# Altium project VincereVentusV3.PrjPcb
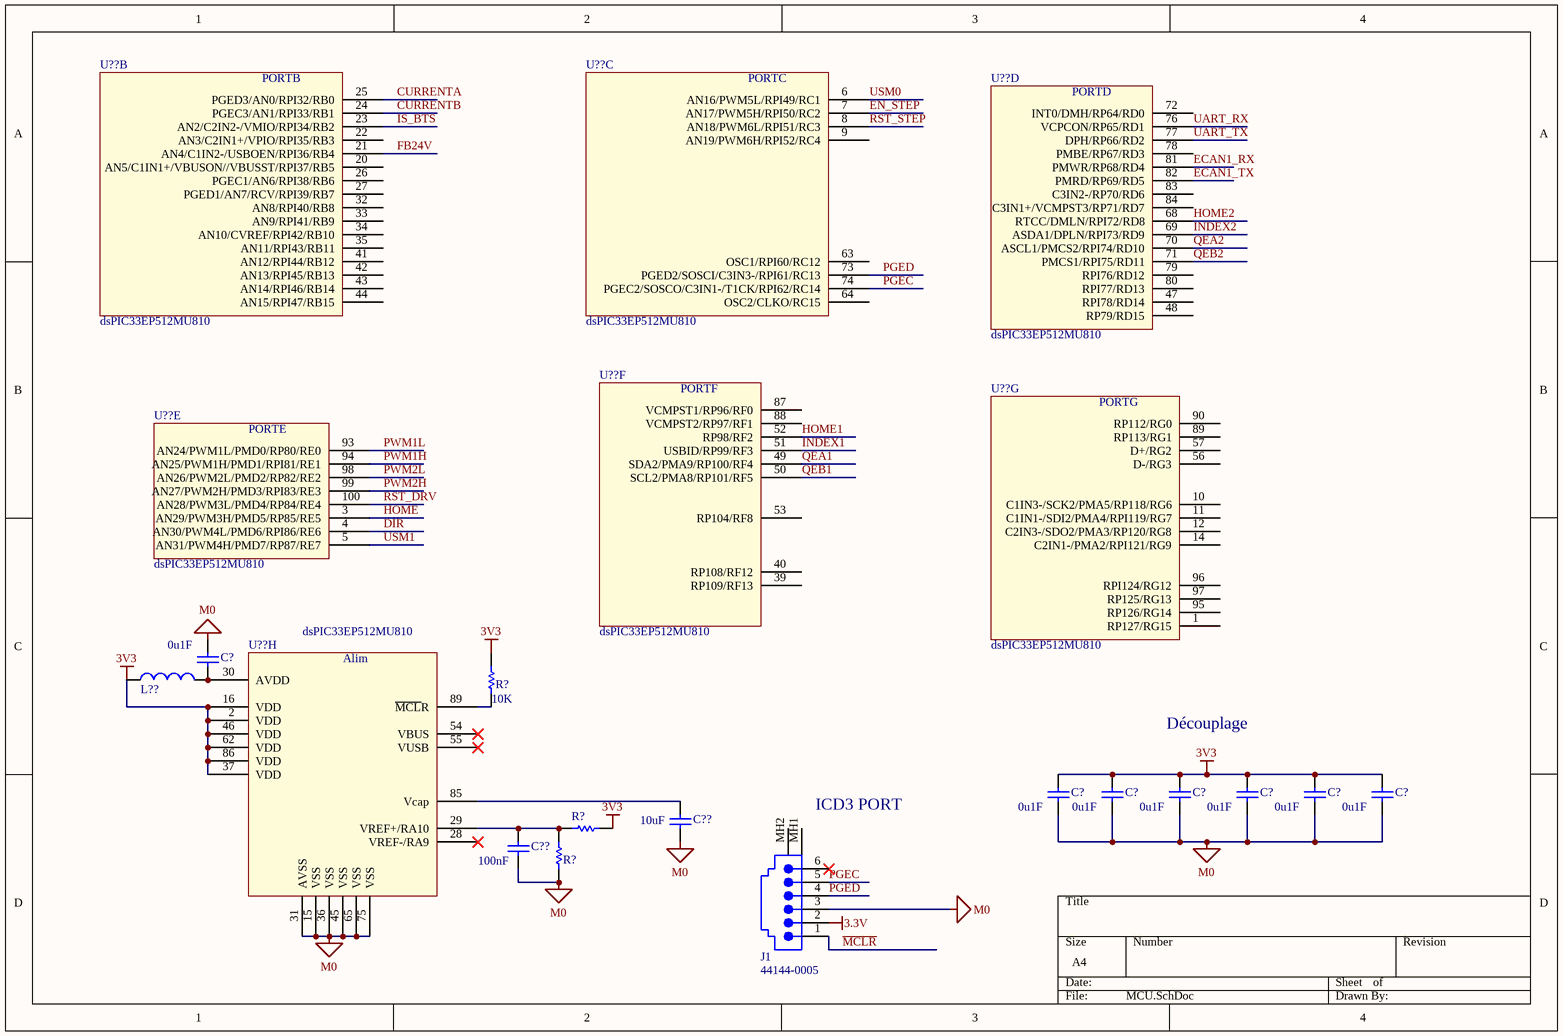
[diagram p0: MCU.SchDoc]
5 sheets, 161 parts. Net scope: global (net labels, ports and power ports of the same name join across sheets).
Board file: HARDWARE_DRIVE_V3.PcbDoc
Sheets:
  MCU.SchDoc
  MOTOR_DRIVER1.SchDoc
  ALIM.SchDoc
  MOTOR_DRIVERS2.SchDoc
  Connectors.SchDoc

## Sheet MCU.SchDoc
size A4

### Parts
(Parts that share a designator on the sheet are numbered #1, #2 ... from top to bottom, then left to right.)
C?#1  value 0u1F  [0603]  (hidden comment: C0603)
C?#2  value 0u1F  [0603]  (hidden comment: C0603)
C?#3  value 0u1F  [0603]  (hidden comment: C0603)
C?#4  value 0u1F  [0603]  (hidden comment: C0603)
C?#5  value 0u1F  [0603]  (hidden comment: C0603)
C?#6  value 0u1F  [0603]  (hidden comment: C0603)
C?#7  value 0u1F  [0603]  (hidden comment: C0603)
C??#1  10uF  [C0805]
C??#2  100nF  [C0805]
J1  44144-0005  [44144-0005]
L??  Ferrite_0805  [R0805]  (value not drawn)
R?#1  10K  [R0805]
R?#2  (no value)  [R0805]
R?#3  (no value)  [R0805]
U??#1  dsPIC33EP512MU810  (part C of 8)
U??#2  dsPIC33EP512MU810  (part B of 8)
U??#3  dsPIC33EP512MU810  (part D of 8)
U??#4  dsPIC33EP512MU810  (part E of 8)
U??#5  dsPIC33EP512MU810  (part G of 8)
U??#6  dsPIC33EP512MU810  (part F of 8)
U??#7  dsPIC33EP512MU810  (part H of 8)

### Nets
3.3V: J1.2
3V3: C?#2.2 C?#3.2 C?#4.2 C?#5.2 C?#6.2 C?#7.2 R?#1.2 R?#2.1 U??#7.2(VDD) U??#7.16(VDD) U??#7.37(VDD) U??#7.46(VDD) U??#7.62(VDD) U??#7.86(VDD)
M0: C?#1.2 C?#2.1 C?#3.1 C?#4.1 C?#5.1 C?#6.1 C?#7.1 C??#1.2 C??#2.2 J1.3 R?#3.1 U??#7.15(VSS) U??#7.31(AVSS) U??#7.36(VSS) U??#7.45(VSS) U??#7.65(VSS) U??#7.75(VSS)
CURRENTA: U??#2.25(PGED3/AN0/RPI32/RB0)
CURRENTB: U??#2.24(PGEC3/AN1/RPI33/RB1)
DIR: U??#4.4(AN30/PWM4L/PMD6/RPI86/RE6)
ECAN1_RX: U??#3.81(PMWR/RP68/RD4)
ECAN1_TX: U??#3.82(PMRD/RP69/RD5)
EN_STEP: U??#1.7(AN17/PWM5H/RPI50/RC2)
FB24V: U??#2.21(AN4/C1IN2-/USBOEN/RPI36/RB4)
HOME: U??#4.3(AN29/PWM3H/PMD5/RP85/RE5)
HOME1: U??#6.52(RP98/RF2)
HOME2: U??#3.68(RTCC/DMLN/RPI72/RD8)
INDEX1: U??#6.51(USBID/RP99/RF3)
INDEX2: U??#3.69(ASDA1/DPLN/RPI73/RD9)
IS_BTS: U??#2.23(AN2/C2IN2-/VMIO/RPI34/RB2)
~{MCLR}: J1.1
PGEC: J1.5 U??#1.74(PGEC2/SOSCO/C3IN1-/T1CK/RPI62/RC14)
PGED: J1.4 U??#1.73(PGED2/SOSCI/C3IN3-/RPI61/RC13)
PWM1H: U??#4.94(AN25/PWM1H/PMD1/RPI81/RE1)
PWM1L: U??#4.93(AN24/PWM1L/PMD0/RP80/RE0)
PWM2H: U??#4.99(AN27/PWM2H/PMD3/RPI83/RE3)
PWM2L: U??#4.98(AN26/PWM2L/PMD2/RP82/RE2)
QEA1: U??#6.49(SDA2/PMA9/RP100/RF4)
QEA2: U??#3.70(ASCL1/PMCS2/RPI74/RD10)
QEB1: U??#6.50(SCL2/PMA8/RP101/RF5)
QEB2: U??#3.71(PMCS1/RPI75/RD11)
RST_DRV: U??#4.100(AN28/PWM3L/PMD4/RP84/RE4)
RST_STEP: U??#1.8(AN18/PWM6L/RPI51/RC3)
UART_RX: U??#3.76(VCPCON/RP65/RD1)
UART_TX: U??#3.77(DPH/RP66/RD2)
USM0: U??#1.6(AN16/PWM5L/RPI49/RC1)
USM1: U??#4.5(AN31/PWM4H/PMD7/RP87/RE7)
NetC?#1_1: C?#1.1 L??.2 U??#7.30(AVDD)
NetC??#1_1: C??#1.1 U??#7.85(Vcap)
NetC??#2_1: C??#2.1 R?#2.2 R?#3.2 U??#7.29(VREF+/RA10)
NetR?#1_1: R?#1.1 U??#7.89(~{MCL}R)

Not connected (* = marked no-connect by the designer): J1 6* MH1(Shield) MH2(Shield); L?? 1; U??#1 9(AN19/PWM6H/RPI52/RC4) 63(OSC1/RPI60/RC12) 64(OSC2/CLKO/RC15); U??#2 20(AN5/C1IN1+/VBUSON//VBUSST/RPI37/RB5) 22(AN3/C2IN1+/VPIO/RPI35/RB3) 26(PGEC1/AN6/RPI38/RB6) 27(PGED1/AN7/RCV/RPI39/RB7) 32(AN8/RPI40/RB8) 33(AN9/RPI41/RB9) 34(AN10/CVREF/RPI42/RB10) 35(AN11/RPI43/RB11) 41(AN12/RPI44/RB12) 42(AN13/RPI45/RB13) 43(AN14/RPI46/RB14) 44(AN15/RPI47/RB15); U??#3 47(RPI78/RD14) 48(RP79/RD15) 72(INT0/DMH/RP64/RD0) 78(PMBE/RP67/RD3) 79(RPI76/RD12) 80(RPI77/RD13) 83(C3IN2-/RP70/RD6) 84(C3IN1+/VCMPST3/RP71/RD7); U??#5 1(RP127/RG15) 10(C1IN3-/SCK2/PMA5/RP118/RG6) 11(C1IN1-/SDI2/PMA4/RPI119/RG7) 12(C2IN3-/SDO2/PMA3/RP120/RG8) 14(C2IN1-/PMA2/RPI121/RG9) 56(D-/RG3) 57(D+/RG2) 89(RP113/RG1) 90(RP112/RG0) 95(RP126/RG14) 96(RPI124/RG12) 97(RP125/RG13); U??#6 39(RP109/RF13) 40(RP108/RF12) 53(RP104/RF8) 87(VCMPST1/RP96/RF0) 88(VCMPST2/RP97/RF1); U??#7 28(VREF-/RA9)* 54(VBUS)* 55(VUSB)*

### Notes on the sheet
- Découplage
- (near J1) ICD3 PORT
- (in symbol dsPIC33EP512MU810-I/PF, part B) PORTB
- (in symbol dsPIC33EP512MU810-I/PF, part C) PORTC
- (in symbol dsPIC33EP512MU810-I/PF, part D) PORTD
- (in symbol dsPIC33EP512MU810-I/PF, part E) PORTE
- (in symbol dsPIC33EP512MU810-I/PF, part F) PORTF
- (in symbol dsPIC33EP512MU810-I/PF, part G) PORTG
- (in symbol dsPIC33EP512MU810-I/PF, part H) Alim

### Library data of the parts
C?#1-C?#7 = C0603: Ceramic Chip Capacitor - Standard; Note: Footprint corresponds to dimensions for bulk cassette packaging. This case size has tightened tolerances.; Published: 17-Jul-2002; LatestRevisionDate: 19-Mar-2004; LatestRevisionNote: Silkscreen size reduced.; DatasheetDocument: Mar-2001; PackageDocument: Mar-2001; PackageReference: 0603; Publisher: Altium Limited; Code_JEITA: 0603; Code_IPC: 1608 [0603]; ComponentLink1Description: Manufacturer Link; ComponentLink1URL: http://www.kemet.com/; ComponentLink2Description: Datasheet; ComponentLink2URL: http://www.kemet.com/kemet/web/homepage/kechome.nsf/vapubfilesname/F3102TA.pdf/$file/F3102TA.pdf
C??#1 C??#2 = C0805: Ceramic Chip Capacitor - Standard; Note: Footprint corresponds to dimensions for bulk cassette packaging. This case size has tightened tolerances.; Value: 100pF; Published: 17-Jul-2002; LatestRevisionDate: 19-Mar-2004; LatestRevisionNote: Silkscreen size reduced.; DatasheetDocument: Mar-2001; PackageDocument: Mar-2001; PackageReference: 0805; Publisher: Altium Limited; Code_JEITA: 0805; Code_IPC: 2012[0805]; ComponentLink1Description: Manufacturer Link; ComponentLink1URL: http://www.kemet.com/; ComponentLink2Description: Datasheet; ComponentLink2URL: http://www.kemet.com/kemet/web/homepage/kechome.nsf/vapubfilesname/F3102TA.pdf/$file/F3102TA.pdf
J1 = 44144-0005: SMT, Right Angle, Low Profile, with Flush Fitting Nails PCB Jack; Ports: 1; Positions/Loaded: Port1 - 6/6; PerformanceCategory: 3; DrillSize: Nominal, Rounded to nearest 0.05mm; PCB_Layout: Complies with Manufacturer's Recommendation.; Published: 25-Jun-2002; DatasheetDocument: 19-Dec-2001; PackageDocument: 19-Dec-2001; PackageReference: 44144-0005; Publisher: Altium Limited; PCB_Mounting: SMT; ComponentLink1Description: Manufacturer Link; ComponentLink1URL: http://www.molex.com/; ComponentLink2Description: Datasheet; ComponentLink2URL: http://www.molex.com/cmc_upload/common_files/1222003_mx44144.pdf
L?? = Ferrite_0805: Ferrite
R?#1-R?#3 = R0805: Resistor 0805
U??#1-U??#7 = dsPIC33EP512MU810-I/PF: High-Performance, 16-bit  Digital Signal Controllers  and Microcontrollers; Supplier 1: Digi-Key; Supplier Part Number 1: DSPIC33EP512MU810-I/PF-ND

## Sheet MOTOR_DRIVER1.SchDoc
size A4
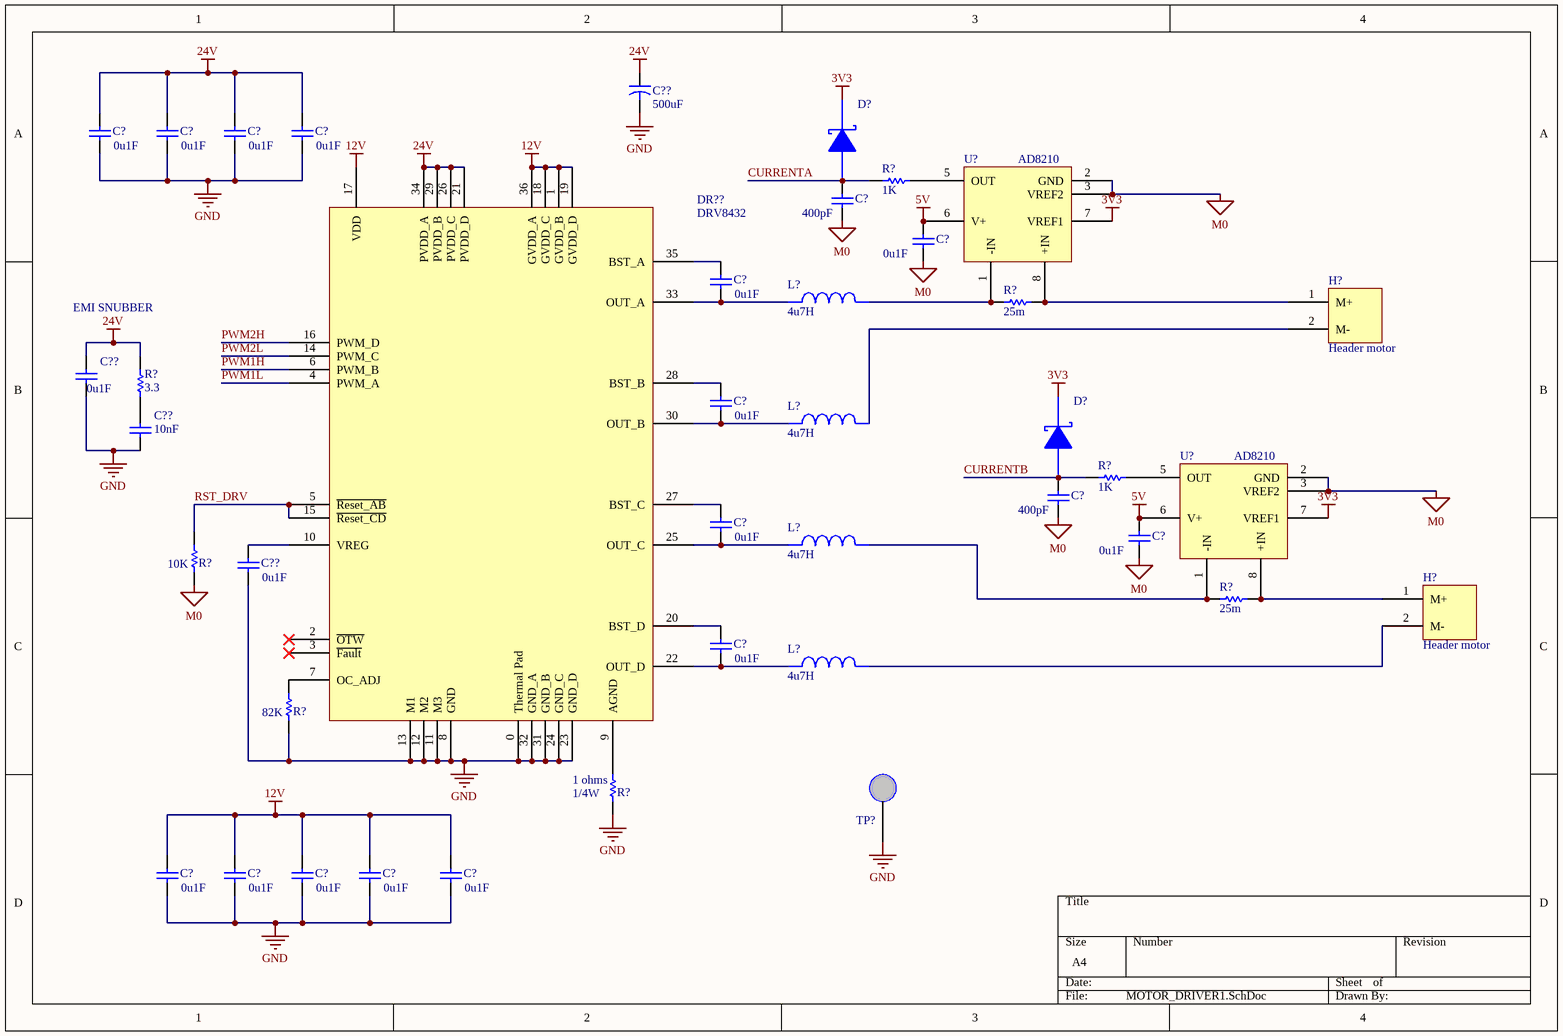
[diagram p1: MOTOR_DRIVER1.SchDoc]

### Parts
(Parts that share a designator on the sheet are numbered #1, #2 ... from top to bottom, then left to right.)
C?#8  value 0u1F  [0603]  (hidden comment: C0603)
C?#9  value 0u1F  [0603]  (hidden comment: C0603)
C?#10  value 0u1F  [0603]  (hidden comment: C0603)
C?#11  value 0u1F  [0603]  (hidden comment: C0603)
C?#12  value 400pF  [0603]  (hidden comment: C0603)
C?#13  value 0u1F  [0603]  (hidden comment: C0603)
C?#14  value 0u1F  [0603]  (hidden comment: C0603)
C?#15  value 0u1F  [0603]  (hidden comment: C0603)
C?#16  value 400pF  [0603]  (hidden comment: C0603)
C?#17  value 0u1F  [0603]  (hidden comment: C0603)
C?#18  value 0u1F  [0603]  (hidden comment: C0603)
C?#19  value 0u1F  [0603]  (hidden comment: C0603)
C?#20  value 0u1F  [0603]  (hidden comment: C0603)
C?#21  value 0u1F  [0603]  (hidden comment: C0603)
C?#22  value 0u1F  [0603]  (hidden comment: C0603)
C?#23  value 0u1F  [0603]  (hidden comment: C0603)
C?#24  value 0u1F  [0603]  (hidden comment: C0603)
C??#3  500uF
C??#4  value 0u1F  [C0805]  (hidden comment: C0805)
C??#5  value 10nF  [C0805]  (hidden comment: C0805)
C??#6  0u1F  [C0805]
D?#1  CRS08  (value not drawn)
D?#2  CRS08  (value not drawn)
DR??  DRV8432  [DRV8432]
H?#1  Header motor  [Header_motor_WEID]
H?#2  Header motor  [Header_motor_WEID]
L?#1  value 4u7H  (hidden comment: ChokeMotor)
L?#2  value 4u7H  (hidden comment: ChokeMotor)
L?#3  value 4u7H  (hidden comment: ChokeMotor)
L?#4  value 4u7H  (hidden comment: ChokeMotor)
R?#4  1K  [R0805]
R?#5  value 25m  [8RB-1206]  (hidden comment: 1206)
R?#6  value 3.3  [8RB-1206]  (hidden comment: 1206)
R?#7  1K  [R0805]
R?#8  10K  [R0805]
R?#9  value 25m  [8RB-1206]  (hidden comment: 1206)
R?#10  82K  [R0805]
R?#11  1 ohms  Power: 1/4W  [R0805]
TP?#1  5003K  [5003K]  (value not drawn)
U?#1  AD8210
U?#2  AD8210

### Nets
3V3: D?#1.2(A) D?#2.2(A) U?#1.7(VREF1) U?#2.7(VREF1)
5V: C?#13.2 C?#18.2 U?#1.6(V+) U?#2.6(V+)
12V: C?#20.2 C?#21.2 C?#22.2 C?#23.2 C?#24.2 DR??.1(GVDD_B) DR??.17(VDD) DR??.18(GVDD_C) DR??.19(GVDD_D) DR??.36(GVDD_A)
24V: C?#8.2 C?#9.2 C?#10.2 C?#11.2 C??#3.1 C??#4.2 DR??.21(PVDD_D) DR??.26(PVDD_C) DR??.29(PVDD_B) DR??.34(PVDD_A) R?#6.1
GND: C?#8.1 C?#9.1 C?#10.1 C?#11.1 C?#20.1 C?#21.1 C?#22.1 C?#23.1 C?#24.1 C??#3.2 C??#4.1 C??#5.1 C??#6.1 DR??.0(Thermal_Pad) DR??.8(GND) DR??.11(M3) DR??.12(M2) DR??.13(M1) DR??.23(GND_D) DR??.24(GND_C) DR??.31(GND_B) DR??.32(GND_A) R?#10.1 R?#11.1 TP?#1.1
M0: C?#12.1 C?#13.1 C?#16.1 C?#18.1 R?#8.1 U?#1.2(GND) U?#1.3(VREF2) U?#2.2(GND) U?#2.3(VREF2)
CURRENTA: C?#12.2 D?#1.1(K) R?#4.2
CURRENTB: C?#16.2 D?#2.1(K) R?#7.2
PWM1H: DR??.6(PWM_B)
PWM1L: DR??.4(PWM_A)
PWM2H: DR??.16(PWM_D)
PWM2L: DR??.14(PWM_C)
RST_DRV: DR??.5(~{Reset_AB}) DR??.15(~{Reset_CD}) R?#8.2
NetC?#14_1: C?#14.1 DR??.33(OUT_A) L?#1.2
NetC?#14_2: C?#14.2 DR??.35(BST_A)
NetC?#15_1: C?#15.1 DR??.30(OUT_B) L?#2.2
NetC?#15_2: C?#15.2 DR??.28(BST_B)
NetC?#17_1: C?#17.1 DR??.25(OUT_C) L?#3.2
NetC?#17_2: C?#17.2 DR??.27(BST_C)
NetC?#19_1: C?#19.1 DR??.22(OUT_D) L?#4.2
NetC?#19_2: C?#19.2 DR??.20(BST_D)
NetC??#5_2: C??#5.2 R?#6.2
NetC??#6_2: C??#6.2 DR??.10(VREG)
NetDR??_7: DR??.7(OC_ADJ) R?#10.2
NetDR??_9: DR??.9(AGND) R?#11.2
NetH?#1_1: H?#1.1(M+) R?#5.1 U?#1.8(+IN)
NetH?#1_2: H?#1.2(M-) L?#2.1
NetH?#2_1: H?#2.1(M+) R?#9.1 U?#2.8(+IN)
NetH?#2_2: H?#2.2(M-) L?#4.1
NetL?#1_1: L?#1.1 R?#5.2 U?#1.1(-IN)
NetL?#3_1: L?#3.1 R?#9.2 U?#2.1(-IN)
NetR?#4_1: R?#4.1 U?#1.5(OUT)
NetR?#7_1: R?#7.1 U?#2.5(OUT)

Not connected (* = marked no-connect by the designer): DR?? 2(~{OTW})* 3(~{Fault})*

### Notes on the sheet
- EMI SNUBBER

### Library data of the parts
C?#8-C?#24 = C0603: as C?#1 on sheet MCU; Published: 17-Jul-2002; LatestRevisionDate: 19-Mar-2004; LatestRevisionNote: Silkscreen size reduced.; DatasheetDocument: Mar-2001; PackageDocument: Mar-2001; PackageReference: 0603; Publisher: Altium Limited; Code_JEITA: 0603; Code_IPC: 1608 [0603]; ComponentLink1Description: Manufacturer Link; ComponentLink1URL: http://www.kemet.com/; ComponentLink2Description: Datasheet; ComponentLink2URL: http://www.kemet.com/kemet/web/homepage/kechome.nsf/vapubfilesname/F3102TA.pdf/$file/F3102TA.pdf
C??#3 = CAPDRV
C??#4 C??#5 = C0805: Ceramic Chip Capacitor - Standard; Note: Footprint corresponds to dimensions for bulk cassette packaging. This case size has tightened tolerances.; Published: 17-Jul-2002; LatestRevisionDate: 19-Mar-2004; LatestRevisionNote: Silkscreen size reduced.; DatasheetDocument: Mar-2001; PackageDocument: Mar-2001; PackageReference: 0805; Publisher: Altium Limited; Code_JEITA: 0805; Code_IPC: 2012[0805]; ComponentLink1Description: Manufacturer Link; ComponentLink1URL: http://www.kemet.com/; ComponentLink2Description: Datasheet; ComponentLink2URL: http://www.kemet.com/kemet/web/homepage/kechome.nsf/vapubfilesname/F3102TA.pdf/$file/F3102TA.pdf
C??#6 = C0805: as C??#1 on sheet MCU; Published: 17-Jul-2002; LatestRevisionDate: 19-Mar-2004; LatestRevisionNote: Silkscreen size reduced.; DatasheetDocument: Mar-2001; PackageDocument: Mar-2001; PackageReference: 0805; Publisher: Altium Limited; Code_JEITA: 0805; Code_IPC: 2012[0805]; ComponentLink1Description: Manufacturer Link; ComponentLink1URL: http://www.kemet.com/; ComponentLink2Description: Datasheet; ComponentLink2URL: http://www.kemet.com/kemet/web/homepage/kechome.nsf/vapubfilesname/F3102TA.pdf/$file/F3102TA.pdf
D?#1 D?#2 = Schottky current sense
DR?? = DRV8432: Dual Full Bridge PWM Motor Driver
H?#1 H?#2 = Header motor: Connecteurs moteur; Manufacturer number: LS 5.08/02/90 3.5SN OR BX
R?#4 R?#7 R?#8 R?#10 R?#11 = R0805: Resistor 0805
R?#5 R?#6 R?#9 = ERJ8RS: Low Ohmic Value Thick Film Chip Resistor, 0.1 Ohm to 0.2 Ohm Range, 1%, 2% and 5% Tolerance, 1206 Size, 0.25 W; Published: 17-Dec-2003; LatestRevisionDate: 19-Mar-2004; LatestRevisionNote: Silkscreen size reduced.; PackageDocument: Mar-2003; PackageReference: 8RB-1206; Publisher: Altium Limited; Code_IPC: 3216 [1206]; ComponentLink1Description: Manufacturer Link; ComponentLink1URL: http://www.panasonic.com/industrial/components/resistive_products.htm; ComponentLink2Description: Datasheet; ComponentLink2URL: http://www.panasonic.com/industrial/components/pdf/AOA0000CE3.pdf
TP?#1 = Testpoint: Testpoint for power
U?#1 U?#2 = AD8210: Bidirectionnal curent sense amplifier

## Sheet ALIM.SchDoc
size A4
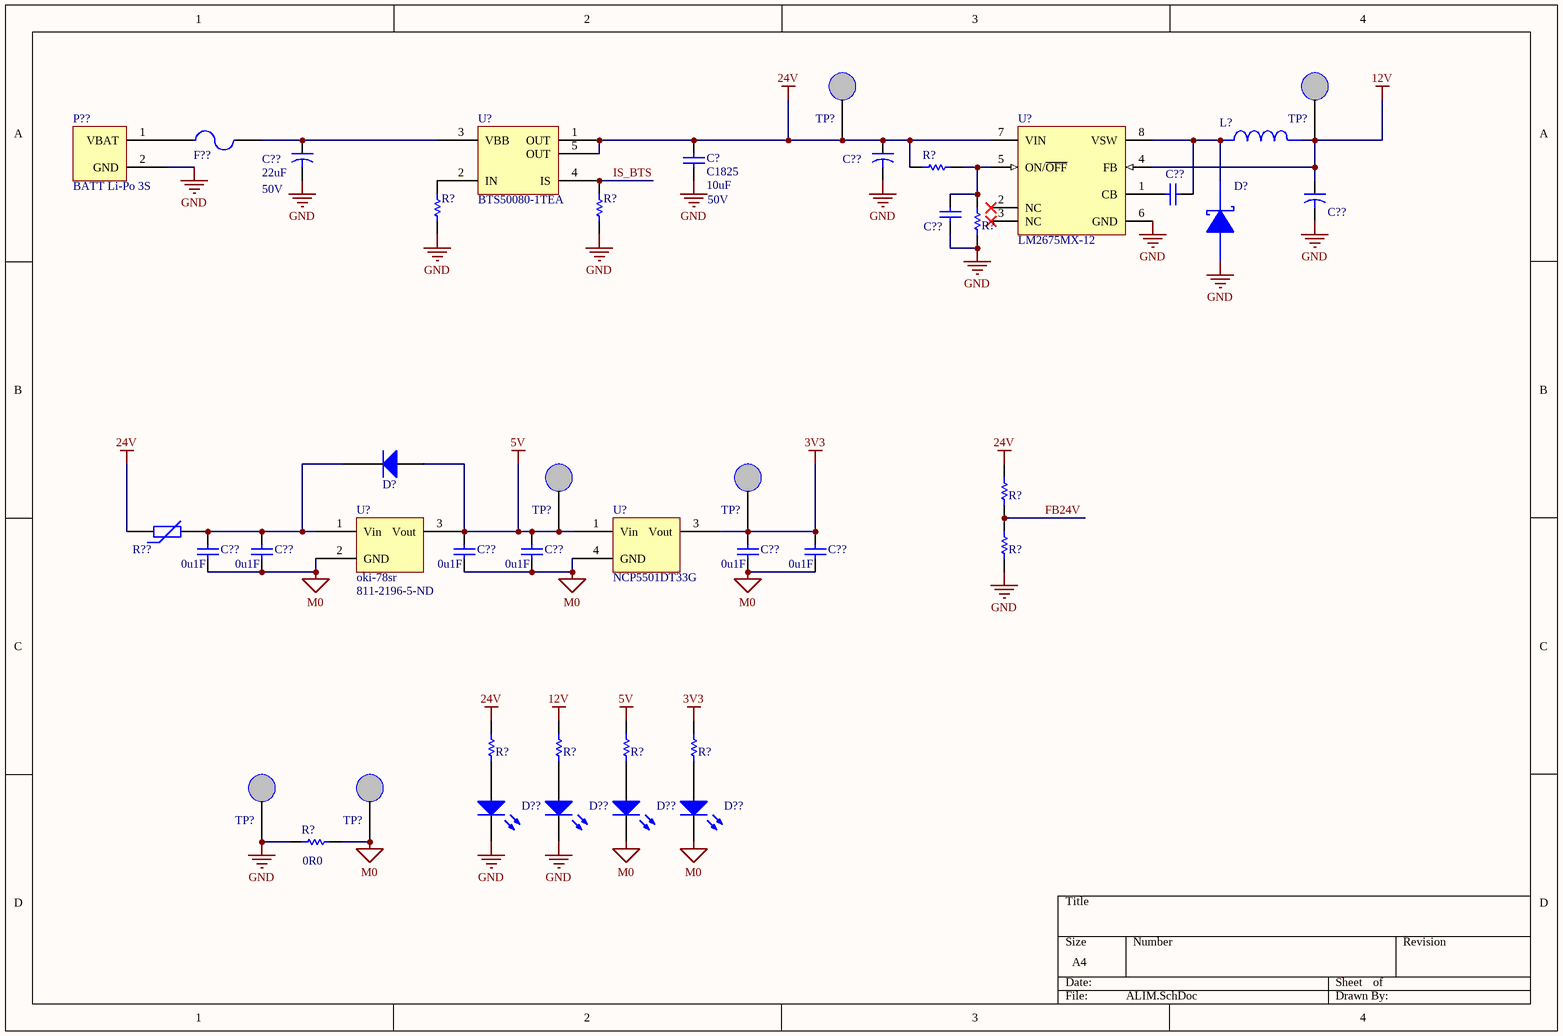
[diagram p2: ALIM.SchDoc]

### Parts
(Parts that share a designator on the sheet are numbered #1, #2 ... from top to bottom, then left to right.)
C?#25  C1825  value 10uF  Voltage: 50V  [1825]
C??#7  22uF  Voltage: 50V
C??#8  (no value)  [EKZE500ELL101MHB5D]
C??#9  1000uF  (value not drawn)
C??#10  C0805  [C0805]  (value not drawn)
C??#11  C0805  [C0805]  (value not drawn)
C??#12  value 0u1F  [C0805]  (hidden comment: C0805)
C??#13  value 0u1F  [C0805]  (hidden comment: C0805)
C??#14  value 0u1F  [C0805]  (hidden comment: C0805)
C??#15  value 0u1F  [C0805]  (hidden comment: C0805)
C??#16  value 0u1F  [C0805]  (hidden comment: C0805)
C??#17  value 0u1F  [C0805]  (hidden comment: C0805)
D?#3  CRS08  (value not drawn)
D?#4  Diode RETOUR  (value not drawn)
D??#1  HSMU-C220  [2.0X1.25X1.2]  (value not drawn)
D??#2  HSMU-C220  [2.0X1.25X1.2]  (value not drawn)
D??#3  HSMU-C220  [2.0X1.25X1.2]  (value not drawn)
D??#4  HSMU-C220  [2.0X1.25X1.2]  (value not drawn)
F??  Fuse BAT  [FUSE_1/4po_dX31.75mm]  (value not drawn)
L?#5  InductorBuck  (value not drawn)
P??#1  BATT Li-Po 3S  [XT60_CON]
R?#12  (no value)  [R0805]
R?#13  (no value)  [R0805]
R?#14  (no value)  [R0805]
R?#15  (no value)  [R0805]
R?#16  (no value)  [R0805]
R?#17  (no value)  [R0805]
R?#18  (no value)  [R0805]
R?#19  (no value)  [R0805]
R?#20  (no value)  [R0805]
R?#21  (no value)  [R0805]
R?#22  value 0R0  [8RB-1206]  (hidden comment: 1206)
R??  PTC  (value not drawn)
TP?#2  5003K  [5003K]  (value not drawn)
TP?#3  5003K  [5003K]  (value not drawn)
TP?#4  5003K  [5003K]  (value not drawn)
TP?#5  5003K  [5003K]  (value not drawn)
TP?#6  5003K  [5003K]  (value not drawn)
TP?#7  5003K  [5003K]  (value not drawn)
U?#3  LM2675MX-12  [M08A_N]
U?#4  BTS50080-1TEA
U?#5  oki-78sr  Supplier Part Number 1: 811-2196-5-ND  [oki-78sr]
U?#6  NCP5501DT33G  [DPAK-3]

### Nets
3V3: C??#16.2 C??#17.2 R?#21.2 TP?#5.1 U?#6.3(Vout)
5V: C??#14.2 C??#15.2 D?#4.1(A) R?#20.2 TP?#4.1 U?#5.3(Vout) U?#6.1(Vin)
12V: C??#9.1 L?#5.1 R?#19.2 TP?#3.1 U?#3.4(FB)
24V: C?#25.2 C??#8.1 R?#12.1 R?#16.2 R?#18.2 R??.1 TP?#2.1 U?#3.7(VIN) U?#4.1(OUT) U?#4.5(OUT)
GND: C?#25.1 C??#7.2 C??#8.2 C??#9.2 C??#11.1 D?#3.1(K) D??#1.2(K) D??#2.2(K) P??#1.2(GND) R?#13.1 R?#14.1 R?#15.1 R?#17.1 R?#22.2 TP?#6.1 U?#3.6(GND)
M0: C??#12.1 C??#13.1 C??#14.1 C??#15.1 C??#16.1 C??#17.1 D??#3.2(K) D??#4.2(K) R?#22.1 TP?#7.1 U?#5.2(GND) U?#6.4(GND)
FB24V: R?#16.1 R?#17.2
IS_BTS: R?#14.2 U?#4.4(IS)
NetC??#7_1: C??#7.1 F??.2 U?#4.3(VBB)
NetC??#10_1: C??#10.1 D?#3.2(A) L?#5.2 U?#3.8(VSW)
NetC??#10_2: C??#10.2 U?#3.1(CB)
NetC??#11_2: C??#11.2 R?#12.2 R?#15.2 U?#3.5(ON/~{OFF})
NetC??#12_2: C??#12.2 C??#13.2 D?#4.2(K) R??.2 U?#5.1(Vin)
NetD??#1_1: D??#1.1(A) R?#18.1
NetD??#2_1: D??#2.1(A) R?#19.1
NetD??#3_1: D??#3.1(A) R?#20.1
NetD??#4_1: D??#4.1(A) R?#21.1
NetF??_1: F??.1 P??#1.1(VBAT)
NetR?#13_2: R?#13.2 U?#4.2(IN)

Not connected (* = marked no-connect by the designer): U?#3 2(NC)* 3(NC)*

### Library data of the parts
C?#25 = C1825: Ceramic Chip Capacitor - Standard; Published: 17-Jul-2002; LatestRevisionDate: 19-Mar-2004; LatestRevisionNote: Silkscreen size reduced.; DatasheetDocument: Mar-2001; PackageDocument: Mar-2001; PackageReference: 1825; Publisher: Altium Limited; Code_JEITA: 1825; Code_IPC: 4564 [1825]; ComponentLink1Description: Manufacturer Link; ComponentLink1URL: http://www.kemet.com/; ComponentLink2Description: Datasheet; ComponentLink2URL: http://www.kemet.com/kemet/web/homepage/kechome.nsf/vapubfilesname/F3102TA.pdf/$file/F3102TA.pdf
C??#7 = CAPINBAT
C??#8 = CAPINBUCK
C??#9 = CAPOUTBUCK
C??#10 C??#11 = C0805: as C??#1 on sheet MCU; Published: 17-Jul-2002; LatestRevisionDate: 19-Mar-2004; LatestRevisionNote: Silkscreen size reduced.; DatasheetDocument: Mar-2001; PackageDocument: Mar-2001; PackageReference: 0805; Publisher: Altium Limited; Code_JEITA: 0805; Code_IPC: 2012[0805]; ComponentLink1Description: Manufacturer Link; ComponentLink1URL: http://www.kemet.com/; ComponentLink2Description: Datasheet; ComponentLink2URL: http://www.kemet.com/kemet/web/homepage/kechome.nsf/vapubfilesname/F3102TA.pdf/$file/F3102TA.pdf
C??#12-C??#17 = C0805: as C??#4 on sheet MOTOR_DRIVER1; Published: 17-Jul-2002; LatestRevisionDate: 19-Mar-2004; LatestRevisionNote: Silkscreen size reduced.; DatasheetDocument: Mar-2001; PackageDocument: Mar-2001; PackageReference: 0805; Publisher: Altium Limited; Code_JEITA: 0805; Code_IPC: 2012[0805]; ComponentLink1Description: Manufacturer Link; ComponentLink1URL: http://www.kemet.com/; ComponentLink2Description: Datasheet; ComponentLink2URL: http://www.kemet.com/kemet/web/homepage/kechome.nsf/vapubfilesname/F3102TA.pdf/$file/F3102TA.pdf
D?#3 = Schkotty Buck
D??#1-D??#4 = HSMU-C220: High Performance Chip LED, Amber; LuminousIntensity: 100mcd (Minimum).; PCB_Layout: Complies with manufacturer's recommendation.; Published: 11-Dec-2002; DatasheetVersion: 30-Apr-2002; PackageVersion: Apr-2002; PackageReference: 2.0X1.25X1.2; Publisher: Altium Limited; PackageDescription: SM LED; 2 Flat Leads; LED_Colour: Amber; ComponentLink1Description: Manufacturer Link; ComponentLink1URL: http://www.avagotech.com/; ComponentLink2Description: Datasheet; ComponentLink2URL: http://cp.literature.agilent.com/litweb/pdf/5988-6549EN.pdf
F?? = Fuse BAT: Fuse BATT; LatestRevisionNote: Re-released for DXP Platform.; Publisher: Altium Limited
P??#1 = XT60: BATT Li-Po 22.2V
R?#12-R?#21 = R0805: Resistor 0805
R?#22 = ERJ8RS: as R?#5 on sheet MOTOR_DRIVER1; Published: 17-Dec-2003; LatestRevisionDate: 19-Mar-2004; LatestRevisionNote: Silkscreen size reduced.; PackageDocument: Mar-2003; PackageReference: 8RB-1206; Publisher: Altium Limited; Code_IPC: 3216 [1206]; ComponentLink1Description: Manufacturer Link; ComponentLink1URL: http://www.panasonic.com/industrial/components/resistive_products.htm; ComponentLink2Description: Datasheet; ComponentLink2URL: http://www.panasonic.com/industrial/components/pdf/AOA0000CE3.pdf
TP?#2-TP?#7 = Testpoint: Testpoint for power
U?#3 = LM2675MX-12: SIMPLE SWITCHER® Power Converter High Efficiency 1A Step-Down Voltage Regulator, 8-pin Narrow SOIC; Manufacturer: National Semiconductor; PackageTopMarking: NSZXTT*2675*M-12; PowerWise: N; Published: 1-Mar-2010; DatasheetVersion: Jun-2005; PackageVersion: revM, May-2009; PackageReference: M08A; Publisher: Altium Limited; PackageDescription: SOIC Narrow, 4.9 x 3.9 x 1.45mm, 8 Lead, 1.27mm Pitch; PartNumber: LM2675MX-12; RoHS: N; PinCount: 8; CompType: Switcher; Code_JEDEC: MS-012-AA; Code_IPC: SOIC127P600-8; ComponentLink1Description: LM2675 Datasheet; ComponentLink1URL: http://www.national.com/ds/LM/LM2675.pdf; ComponentLink2Description: LM2675 Web Page; ComponentLink2URL: http://www.national.com/pf/LM/LM2675.html; ComponentLink3Description: M08A Package Page; ComponentLink3URL: http://www.national.com/packaging/folders/m08a.html
U?#5 = oki-78sr: 5V 1.5A (Vin 7V-36V) swiching power supply - board mount; Supplier 1: Digi-Key
U?#6 = NCP5501DT33G: LDO 3.3V current limited 500 mA

## Sheet MOTOR_DRIVERS2.SchDoc
size A4
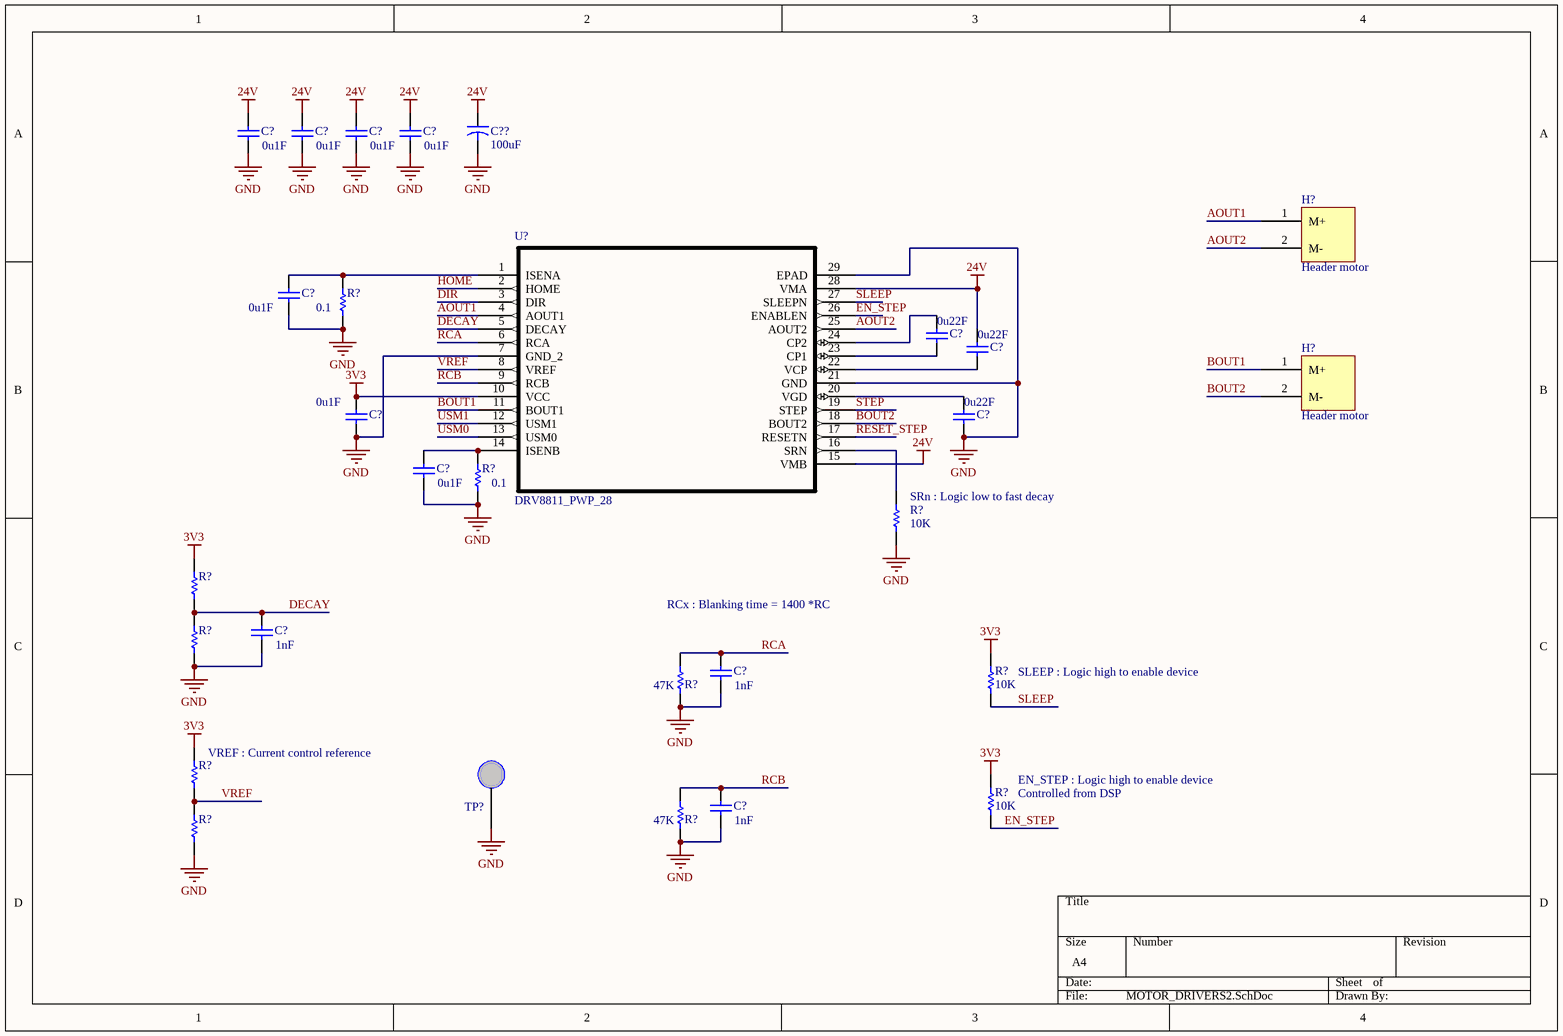
[diagram p3: MOTOR_DRIVERS2.SchDoc]

### Parts
(Parts that share a designator on the sheet are numbered #1, #2 ... from top to bottom, then left to right.)
C?#26  value 0u1F  [0603]  (hidden comment: C0603)
C?#27  value 0u1F  [0603]  (hidden comment: C0603)
C?#28  value 0u1F  [0603]  (hidden comment: C0603)
C?#29  value 0u1F  [0603]  (hidden comment: C0603)
C?#30  value 0u1F  [0603]  (hidden comment: C0603)
C?#31  value 0u22F  [0603]  (hidden comment: C0603)
C?#32  value 0u22F  [0603]  (hidden comment: C0603)
C?#33  value 0u1F  [0603]  (hidden comment: C0603)
C?#34  value 0u22F  [0603]  (hidden comment: C0603)
C?#35  value 0u1F  [0603]  (hidden comment: C0603)
C?#36  value 1nF  [0603]  (hidden comment: C0603)
C?#37  value 1nF  [0603]  (hidden comment: C0603)
C?#38  value 1nF  [0603]  (hidden comment: C0603)
C??#18  100uF
H?#3  Header motor  [Header_motor_WEID]
H?#4  Header motor  [Header_motor_WEID]
R?#23  value 0.1  [8RB-1206]  (hidden comment: 1206)
R?#24  value 0.1  [8RB-1206]  (hidden comment: 1206)
R?#25  10K  [R0805]
R?#26  (no value)  [R0805]
R?#27  (no value)  [R0805]
R?#28  47K  [R0805]
R?#29  10K  [R0805]
R?#30  (no value)  [R0805]
R?#31  10K  [R0805]
R?#32  47K  [R0805]
R?#33  (no value)  [R0805]
TP?#8  5003K  [5003K]  (value not drawn)
U?#7  DRV8811_PWP_28  [PWP28_5P18X3P1-M]

### Nets
3V3: C?#33.2 R?#26.1 R?#29.1 R?#30.1 R?#31.1 U?#7.10(VCC)
24V: C?#26.2 C?#27.2 C?#28.2 C?#29.2 C?#32.2 C??#18.1 U?#7.15(VMB) U?#7.28(VMA)
GND: C?#26.1 C?#27.1 C?#28.1 C?#29.1 C?#30.1 C?#33.1 C?#34.1 C?#35.1 C?#36.1 C?#37.1 C?#38.1 C??#18.2 R?#23.1 R?#24.1 R?#25.2 R?#27.2 R?#28.1 R?#32.1 R?#33.2 TP?#8.1 U?#7.7(GND_2) U?#7.21(GND) U?#7.29(EPAD)
AOUT1: H?#3.1(M+) U?#7.4(AOUT1)
AOUT2: H?#3.2(M-) U?#7.25(AOUT2)
BOUT1: H?#4.1(M+) U?#7.11(BOUT1)
BOUT2: H?#4.2(M-) U?#7.18(BOUT2)
DECAY: C?#36.2 R?#26.2 R?#27.1 U?#7.5(DECAY)
DIR: U?#7.3(DIR)
EN_STEP: R?#31.2 U?#7.26(ENABLEN)
HOME: U?#7.2(HOME)
RCA: C?#37.2 R?#28.2 U?#7.6(RCA)
RCB: C?#38.2 R?#32.2 U?#7.9(RCB)
RESET_STEP: U?#7.17(RESETN)
SLEEP: R?#29.2 U?#7.27(SLEEPN)
STEP: U?#7.19(STEP)
USM0: U?#7.13(USM0)
USM1: U?#7.12(USM1)
VREF: R?#30.2 R?#33.1 U?#7.8(VREF)
NetC?#30_2: C?#30.2 R?#23.2 U?#7.1(ISENA)
NetC?#31_1: C?#31.1 U?#7.23(CP1)
NetC?#31_2: C?#31.2 U?#7.24(CP2)
NetC?#32_1: C?#32.1 U?#7.22(VCP)
NetC?#34_2: C?#34.2 U?#7.20(VGD)
NetC?#35_2: C?#35.2 R?#24.2 U?#7.14(ISENB)
NetR?#25_1: R?#25.1 U?#7.16(SRN)

### Notes on the sheet
- (near R?#25) SRn : Logic low to fast decay
- RCx : Blanking time = 1400 *RC
- (near R?#29) SLEEP : Logic high to enable device
- (near R?#30) VREF : Current control reference
- (near R?#31) EN_STEP : Logic high to enable device
- (near R?#31) Controlled from DSP

### Library data of the parts
C?#26-C?#38 = C0603: as C?#1 on sheet MCU; Published: 17-Jul-2002; LatestRevisionDate: 19-Mar-2004; LatestRevisionNote: Silkscreen size reduced.; DatasheetDocument: Mar-2001; PackageDocument: Mar-2001; PackageReference: 0603; Publisher: Altium Limited; Code_JEITA: 0603; Code_IPC: 1608 [0603]; ComponentLink1Description: Manufacturer Link; ComponentLink1URL: http://www.kemet.com/; ComponentLink2Description: Datasheet; ComponentLink2URL: http://www.kemet.com/kemet/web/homepage/kechome.nsf/vapubfilesname/F3102TA.pdf/$file/F3102TA.pdf
C??#18 = CAP_STEP
H?#3 H?#4 = Header motor: as H?#1 on sheet MOTOR_DRIVER1
R?#23 R?#24 = ERJ8RS: as R?#5 on sheet MOTOR_DRIVER1; Published: 17-Dec-2003; LatestRevisionDate: 19-Mar-2004; LatestRevisionNote: Silkscreen size reduced.; PackageDocument: Mar-2003; PackageReference: 8RB-1206; Publisher: Altium Limited; Code_IPC: 3216 [1206]; ComponentLink1Description: Manufacturer Link; ComponentLink1URL: http://www.panasonic.com/industrial/components/resistive_products.htm; ComponentLink2Description: Datasheet; ComponentLink2URL: http://www.panasonic.com/industrial/components/pdf/AOA0000CE3.pdf
R?#25-R?#33 = R0805: Resistor 0805
TP?#8 = Testpoint: Testpoint for power
U?#7 = DRV8811_PWP_28: Imported; Manufacturer: Texas Instruments; INDUSTRY_STD_PKG_TYPE: HTSSOP; FAMILY_NAME: STEPPER DRIVER; PIN_COUNT: 28; PACKAGE_DESIGNATOR: PWP; Datasheet URL: http://www.ti.com/lit/gpn/DRV8811; GENERIC_PART_NUMBER: DRV8811; VENDOR: Texas Instruments; MANUFACTURER_PART_NUMBER: drv8811_pwp_28

## Sheet Connectors.SchDoc
size A4
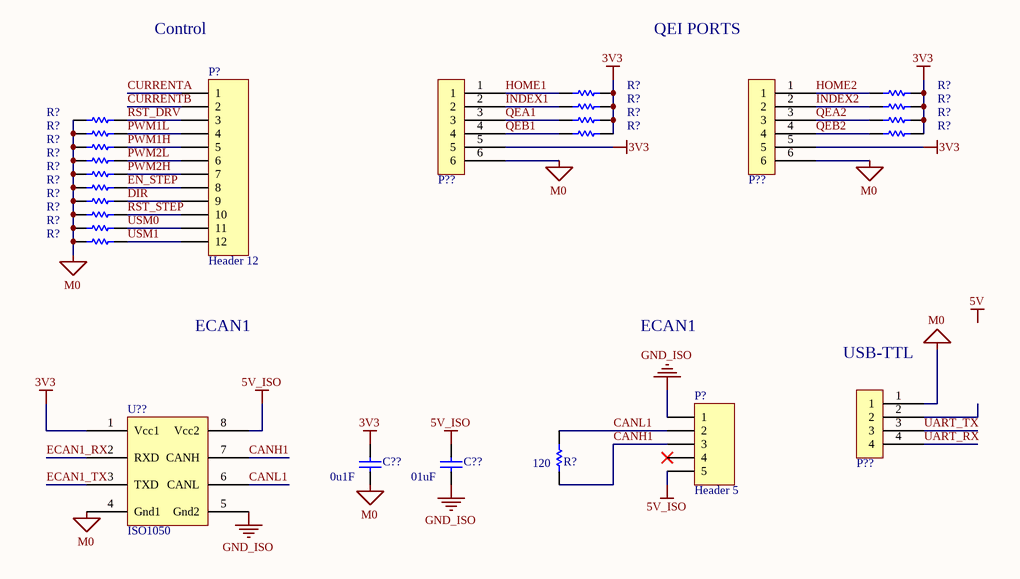
[diagram p4: Connectors.SchDoc]

### Parts
(Parts that share a designator on the sheet are numbered #1, #2 ... from top to bottom, then left to right.)
C??#19  0u1F  [C0805]
C??#20  01uF  [C0805]
P?#1  Header 12  [HDR1X12]
P?#2  Header 5  [HDR1X5]
P??#2  Header 6_WEID  [HEADER_6_WEID]  (value not drawn)
P??#3  Header 6_WEID  [HEADER_6_WEID]  (value not drawn)
P??#4  Header 4_WEID  [HEADER_4_WEID]  (value not drawn)
R?#34  10K  [R0805]  (value not drawn)
R?#35  10K  [R0805]  (value not drawn)
R?#36  10K  [R0805]  (value not drawn)
R?#37  10K  [R0805]  (value not drawn)
R?#38  10K  [R0805]  (value not drawn)
R?#39  10K  [R0805]  (value not drawn)
R?#40  10K  [R0805]  (value not drawn)
R?#41  10K  [R0805]  (value not drawn)
R?#42  10K  [R0805]  (value not drawn)
R?#43  10K  [R0805]  (value not drawn)
R?#44  10K  [R0805]  (value not drawn)
R?#45  10K  [R0805]  (value not drawn)
R?#46  10K  [R0805]  (value not drawn)
R?#47  10K  [R0805]  (value not drawn)
R?#48  10K  [R0805]  (value not drawn)
R?#49  10K  [R0805]  (value not drawn)
R?#50  10K  [R0805]  (value not drawn)
R?#51  10K  [R0805]  (value not drawn)
R?#52  120  [R0805]
U??#8  ISO1050  [ISO1050]

### Nets
3V3: C??#19.1 P??#2.5 P??#3.5 R?#34.1 R?#35.1 R?#36.1 R?#37.1 R?#39.1 R?#40.1 R?#42.1 R?#43.1 U??#8.1(Vcc1)
5V_ISO: C??#20.1 P?#2.5 U??#8.8(Vcc2)
GND_ISO: C??#20.2 P?#2.1 U??#8.5(Gnd2)
M0: C??#19.2 P??#2.6 P??#3.6 P??#4.1 R?#38.2 R?#41.2 R?#44.2 R?#45.2 R?#46.2 R?#47.2 R?#48.2 R?#49.2 R?#50.2 R?#51.2 U??#8.4(Gnd1)
CANH1: P?#2.3 R?#52.2 U??#8.7(CANH)
CANL1: P?#2.2 R?#52.1 U??#8.6(CANL)
CURRENTA: P?#1.1
CURRENTB: P?#1.2
DIR: P?#1.9 R?#48.1
ECAN1_RX: U??#8.2(RXD)
ECAN1_TX: U??#8.3(TXD)
EN_STEP: P?#1.8 R?#47.1
HOME1: P??#2.1 R?#34.2
HOME2: P??#3.1 R?#35.2
INDEX1: P??#2.2 R?#36.2
INDEX2: P??#3.2 R?#37.2
PWM1H: P?#1.5 R?#44.1
PWM1L: P?#1.4 R?#41.1
PWM2H: P?#1.7 R?#46.1
PWM2L: P?#1.6 R?#45.1
QEA1: P??#2.3 R?#39.2
QEA2: P??#3.3 R?#40.2
QEB1: P??#2.4 R?#42.2
QEB2: P??#3.4 R?#43.2
RST_DRV: P?#1.3 R?#38.1
RST_STEP: P?#1.10 R?#49.1
UART_RX: P??#4.4
UART_TX: P??#4.3
USM0: P?#1.11 R?#50.1
USM1: P?#1.12 R?#51.1

Not connected (* = marked no-connect by the designer): P?#2 4*; P??#4 2

### Notes on the sheet
- Control
- QEI PORTS
- ECAN1
- (near P??#4) USB-TTL
- Labels drawn without touching a wire or pin: 5V

### Library data of the parts
C??#19 C??#20 = C0805: as C??#1 on sheet MCU; Published: 17-Jul-2002; LatestRevisionDate: 19-Mar-2004; LatestRevisionNote: Silkscreen size reduced.; DatasheetDocument: Mar-2001; PackageDocument: Mar-2001; PackageReference: 0805; Publisher: Altium Limited; Code_JEITA: 0805; Code_IPC: 2012[0805]; ComponentLink1Description: Manufacturer Link; ComponentLink1URL: http://www.kemet.com/; ComponentLink2Description: Datasheet; ComponentLink2URL: http://www.kemet.com/kemet/web/homepage/kechome.nsf/vapubfilesname/F3102TA.pdf/$file/F3102TA.pdf
P?#1 = Header 12: Header, 12-Pin; LatestRevisionDate: 17-Jul-2002; LatestRevisionNote: Re-released for DXP Platform.; Publisher: Altium Limited
P?#2 = Header 5: Header, 5-Pin; LatestRevisionDate: 17-Jul-2002; LatestRevisionNote: Re-released for DXP Platform.; Publisher: Altium Limited
R?#34-R?#52 = R0805: Resistor 0805
U??#8 = ISO1050: Isolated CAN transceiver

## Nets that join several sheets
3V3: MCU (14 pins), MOTOR_DRIVER1 (D?#1.2 D?#2.2 U?#1.7 U?#2.7), ALIM (5 pins), MOTOR_DRIVERS2 (6 pins), Connectors (12 pins)
5V: MOTOR_DRIVER1 (C?#13.2 C?#18.2 U?#1.6 U?#2.6), ALIM (7 pins)
12V: MOTOR_DRIVER1 (10 pins), ALIM (5 pins)
24V: MOTOR_DRIVER1 (11 pins), ALIM (10 pins), MOTOR_DRIVERS2 (8 pins)
GND: MOTOR_DRIVER1 (25 pins), ALIM (16 pins), MOTOR_DRIVERS2 (23 pins)
M0: MCU (17 pins), MOTOR_DRIVER1 (9 pins), ALIM (12 pins), Connectors (15 pins)
CURRENTA: MCU (U??#2.25), MOTOR_DRIVER1 (C?#12.2 D?#1.1 R?#4.2), Connectors (P?#1.1)
CURRENTB: MCU (U??#2.24), MOTOR_DRIVER1 (C?#16.2 D?#2.1 R?#7.2), Connectors (P?#1.2)
DIR: MCU (U??#4.4), MOTOR_DRIVERS2 (U?#7.3), Connectors (P?#1.9 R?#48.1)
ECAN1_RX: MCU (U??#3.81), Connectors (U??#8.2)
ECAN1_TX: MCU (U??#3.82), Connectors (U??#8.3)
EN_STEP: MCU (U??#1.7), MOTOR_DRIVERS2 (R?#31.2 U?#7.26), Connectors (P?#1.8 R?#47.1)
FB24V: MCU (U??#2.21), ALIM (R?#16.1 R?#17.2)
HOME: MCU (U??#4.3), MOTOR_DRIVERS2 (U?#7.2)
HOME1: MCU (U??#6.52), Connectors (P??#2.1 R?#34.2)
HOME2: MCU (U??#3.68), Connectors (P??#3.1 R?#35.2)
INDEX1: MCU (U??#6.51), Connectors (P??#2.2 R?#36.2)
INDEX2: MCU (U??#3.69), Connectors (P??#3.2 R?#37.2)
IS_BTS: MCU (U??#2.23), ALIM (R?#14.2 U?#4.4)
PWM1H: MCU (U??#4.94), MOTOR_DRIVER1 (DR??.6), Connectors (P?#1.5 R?#44.1)
PWM1L: MCU (U??#4.93), MOTOR_DRIVER1 (DR??.4), Connectors (P?#1.4 R?#41.1)
PWM2H: MCU (U??#4.99), MOTOR_DRIVER1 (DR??.16), Connectors (P?#1.7 R?#46.1)
PWM2L: MCU (U??#4.98), MOTOR_DRIVER1 (DR??.14), Connectors (P?#1.6 R?#45.1)
QEA1: MCU (U??#6.49), Connectors (P??#2.3 R?#39.2)
QEA2: MCU (U??#3.70), Connectors (P??#3.3 R?#40.2)
QEB1: MCU (U??#6.50), Connectors (P??#2.4 R?#42.2)
QEB2: MCU (U??#3.71), Connectors (P??#3.4 R?#43.2)
RST_DRV: MCU (U??#4.100), MOTOR_DRIVER1 (DR??.5 DR??.15 R?#8.2), Connectors (P?#1.3 R?#38.1)
RST_STEP: MCU (U??#1.8), Connectors (P?#1.10 R?#49.1)
UART_RX: MCU (U??#3.76), Connectors (P??#4.4)
UART_TX: MCU (U??#3.77), Connectors (P??#4.3)
USM0: MCU (U??#1.6), MOTOR_DRIVERS2 (U?#7.13), Connectors (P?#1.11 R?#50.1)
USM1: MCU (U??#4.5), MOTOR_DRIVERS2 (U?#7.12), Connectors (P?#1.12 R?#51.1)